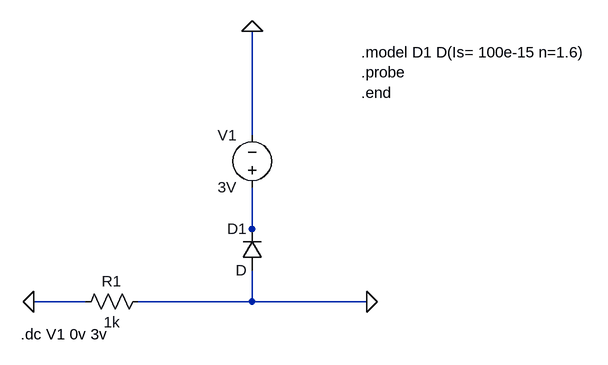
[diagram p0: schematic 3.7A.asc]
3.7A.asc, the LTspice schematic file:
Version 4
SHEET 1 880 680
WIRE 128 -96 128 -256
WIRE 128 48 128 -16
WIRE 128 64 128 48
WIRE -128 160 -208 160
WIRE 128 160 128 112
WIRE 128 160 -48 160
WIRE 304 160 128 160
FLAG 128 -256 0
FLAG 304 160 0
FLAG -208 160 0
SYMBOL res -32 144 R90
WINDOW 0 0 56 VBottom 2
WINDOW 3 32 56 VTop 2
SYMATTR InstName R1
SYMATTR Value 1k
SYMBOL diode 144 112 R180
WINDOW 0 24 64 Left 2
WINDOW 3 24 0 Left 2
SYMATTR InstName D1
SYMBOL voltage 128 0 R180
WINDOW 0 24 96 Left 2
WINDOW 3 24 16 Left 2
WINDOW 123 0 0 Left 2
WINDOW 39 0 0 Left 2
SYMATTR InstName V1
SYMATTR Value 3V
TEXT 296 -224 Left 2 !.model D1 D(Is= 100e-15 n=1.6)\n.probe\n.end
TEXT -228 210 Left 2 !.dc V1 0v 3v

The netlist it stands for:
* 3.7A.asc
R1 0 0 1k
D1 0 N001 D
V1 N001 0 3V
.model D D
.lib standard.dio
.model D1 D(Is= 100e-15 n=1.6)
.probe
.end
.dc V1 0v 3v
.backanno
.end